# Altium schematic sheet Onboard_IO.SchDoc
size Tabloid; SheetNumber: 3; SheetTotal: 5; Sheet_Name: Onboard IO; Size: 11x17
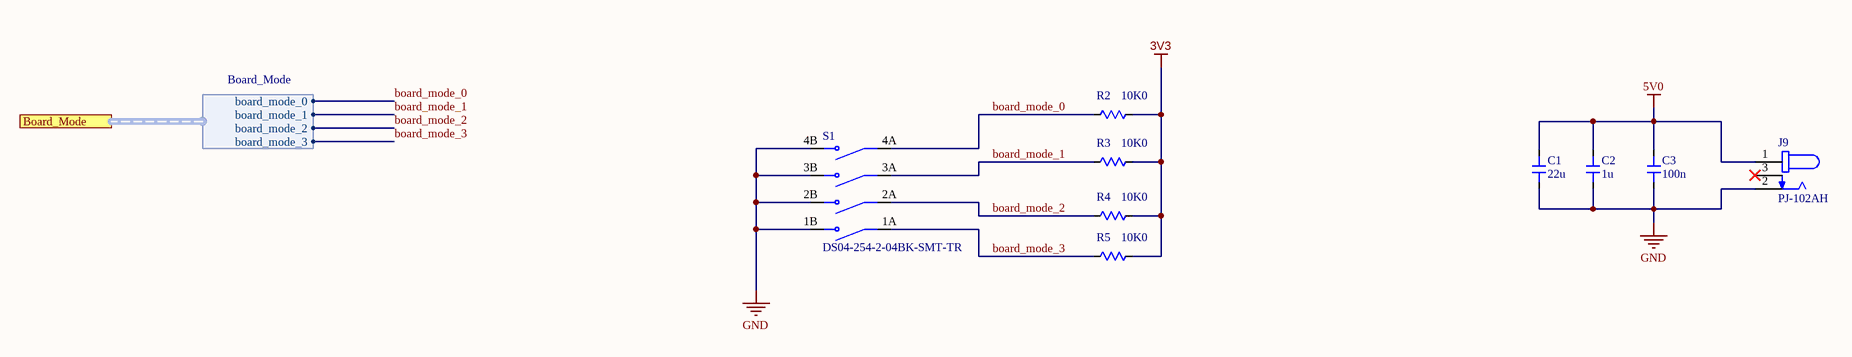
[diagram p0: Onboard_IO.SchDoc]

## Parts
C1  22u  [0805_CAPACITOR]
C2  1u  [0603_CAPACITOR]
C3  100n  [0603_CAPACITOR]
J9  PJ-102AH  [CUI_PJ-102AH]
R2  10K0  [0603_RESISTOR]
R3  10K0  [0603_RESISTOR]
R4  10K0  [0603_RESISTOR]
R5  10K0  [0603_RESISTOR]
S1  DS04-254-2-04BK-SMT-TR  [SW_DS04-254-2-04BK-SMT-TR]

## Ports
Board_Mode (harness Board_Mode)

## Harnesses
Board_Mode: board_mode_0, board_mode_1, board_mode_2, board_mode_3

## Nets
3V3: R2.2 R3.2 R4.2 R5.2
5V0: C1.2 C2.2 C3.2 J9.1
GND: C1.1 C2.1 C3.1 J9.2 S1.1B(NO1) S1.2B(NO2) S1.3B(NO3) S1.4B(NO4)
board_mode_0: R2.1 S1.4A(COM4) ; port Board_Mode.board_mode_0
board_mode_1: R3.1 S1.3A(COM3) ; port Board_Mode.board_mode_1
board_mode_2: R4.1 S1.2A(COM2) ; port Board_Mode.board_mode_2
board_mode_3: R5.1 S1.1A(COM1) ; port Board_Mode.board_mode_3

Not connected (* = marked no-connect by the designer): J9 3*

## Notes on the sheet
- Sheet Name
- Project Title
- Global Project
- Size
- Group
- Revision
- Date
- Sheet
- of
- Filename
- Designers

## Library data of the parts
C1-C3 = Capacitor
J9 = CON_PWR_24V_5A: Power Barrel Connector Jack 2.00mm ID (0.079"), 5.50mm OD (0.217") Through Hole, Right Angle; MF: Same Sky; SnapEDA_Link: https://www.snapeda.com/parts/PJ-102AH/Same+Sky/view-part/?ref=snap; Package: None; Value: *; MP: PJ-102AH; Check_prices: https://www.snapeda.com/parts/PJ-102AH/Same+Sky/view-part/?ref=eda
R2-R5 = Resistor: GRAMS Lib Spec: 2.7
S1 = SW_DIP_4_SMT: Dip Switch SPST 4 Position Surface Mount Slide (Standard) Actuator 25mA 24VDC; MF: Same Sky; SnapEDA_Link: https://www.snapeda.com/parts/DS04-254-2-04BK-SMT-TR/Same+Sky/view-part/?ref=snap; Package: None; Value: *; MP: DS04-254-2-04BK-SMT-TR; Check_prices: https://www.snapeda.com/parts/DS04-254-2-04BK-SMT-TR/Same+Sky/view-part/?ref=eda